# EAGLE schematic irboard (EAGLE 9.5.1)
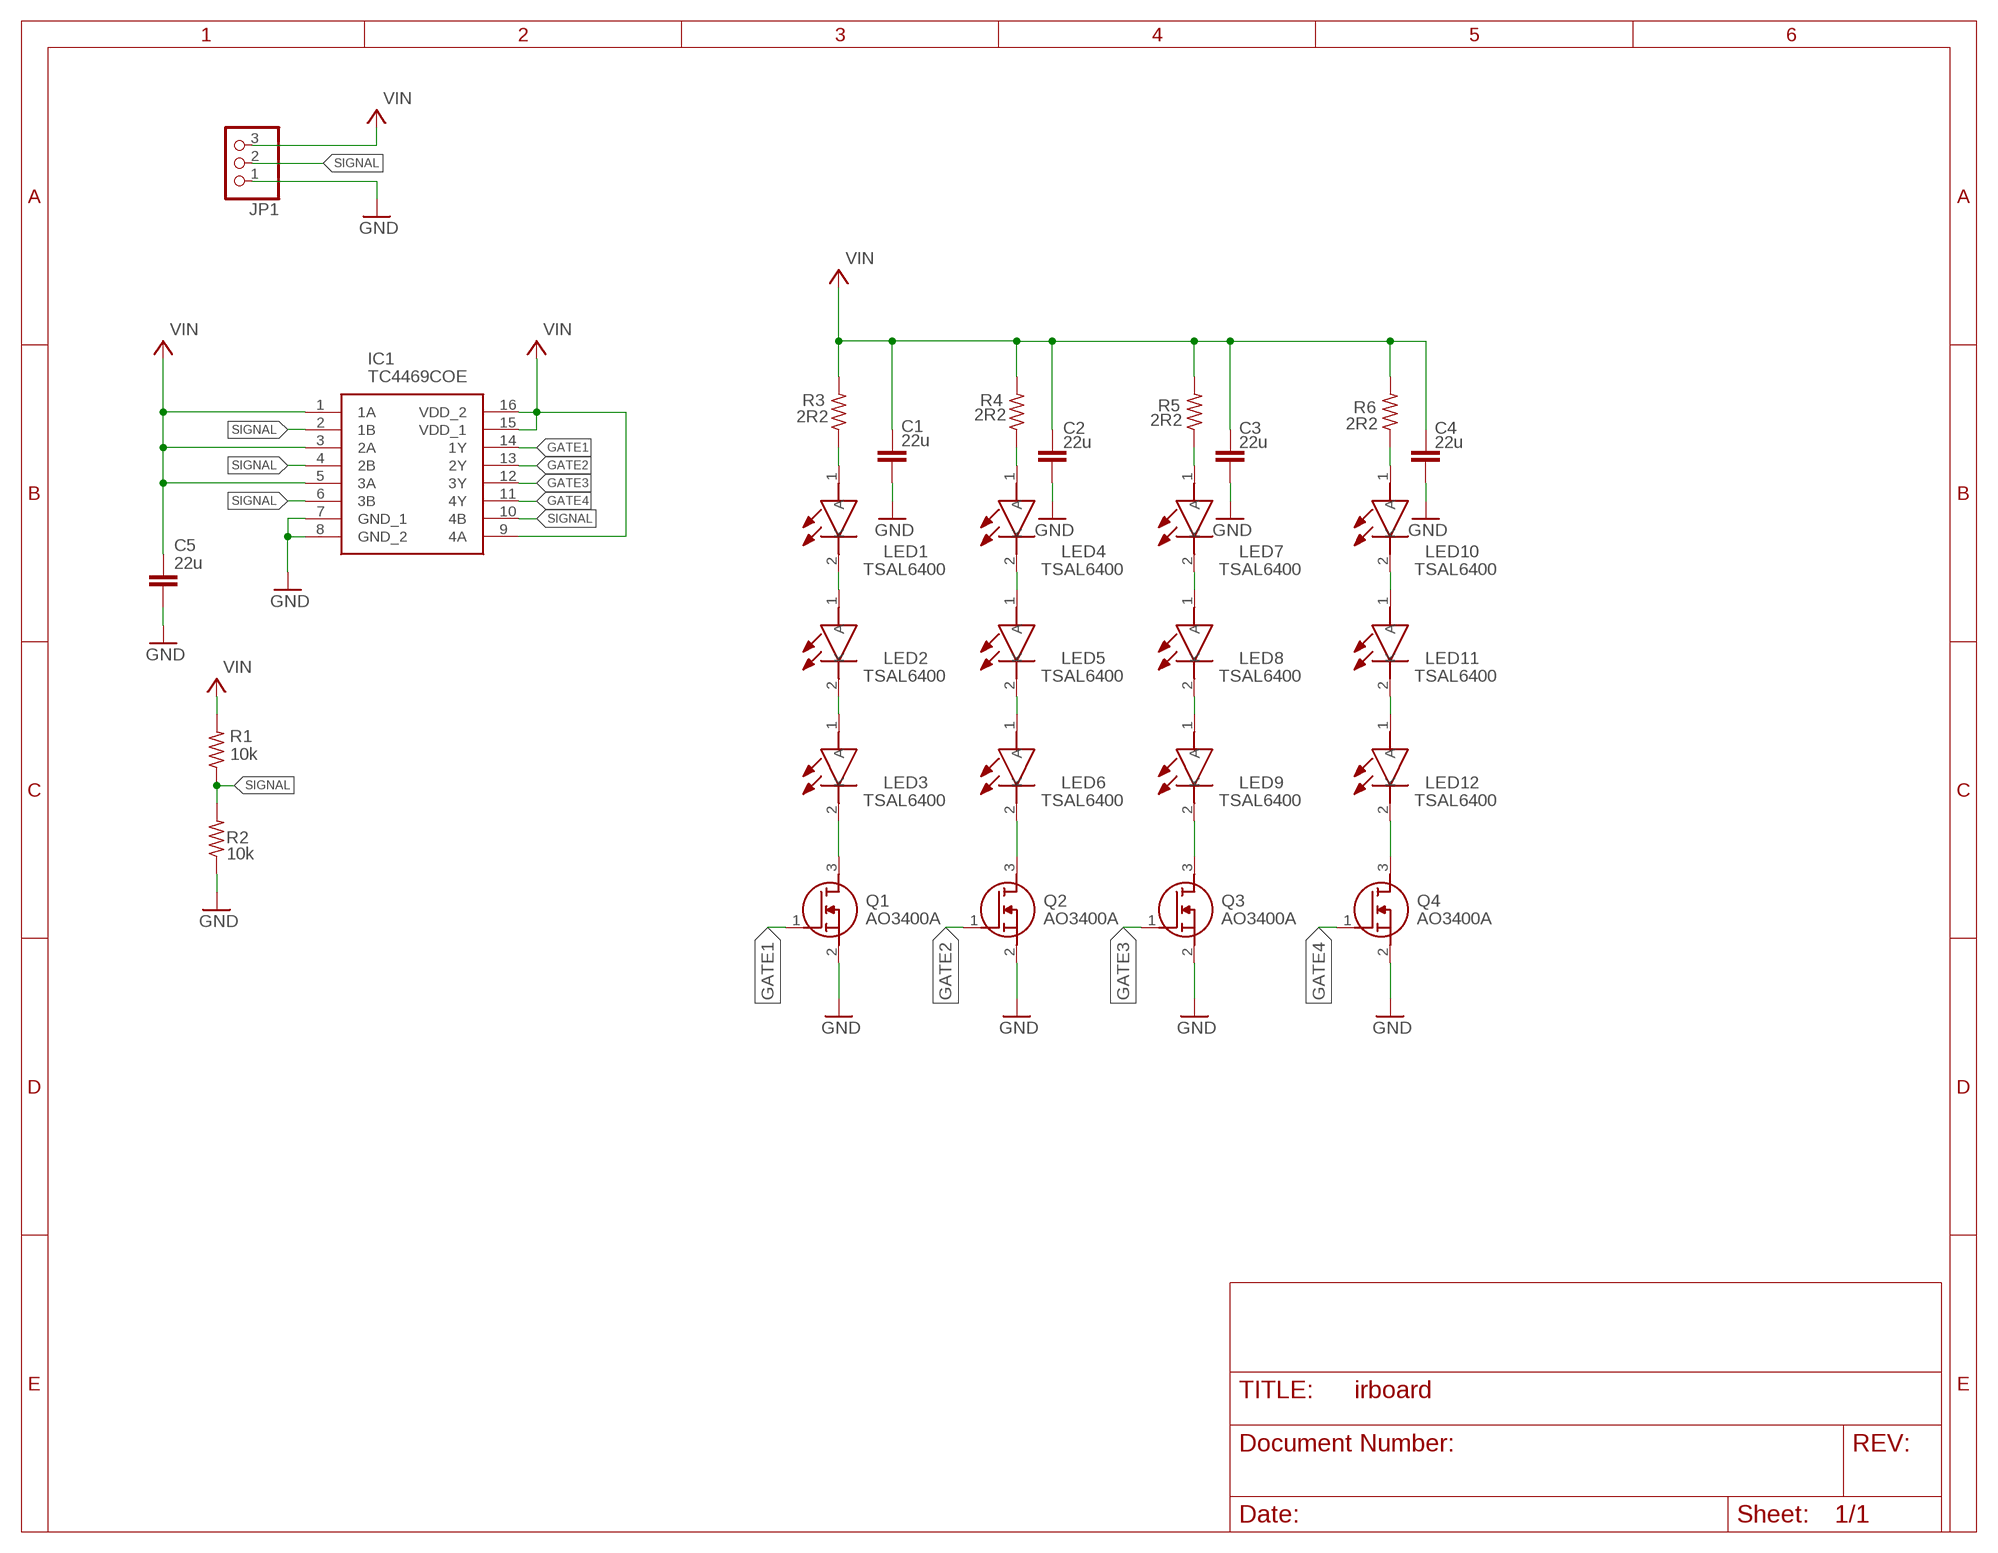
[diagram p0: schematic, sheet 1]

## Parts
C1  22u  CAP_SMD0805  [C0805]
C2  22u  CAP_SMD0805  [C0805]
C3  22u  CAP_SMD0805  [C0805]
C4  22u  CAP_SMD0805  [C0805]
C5  22u  CAP_SMD0805  [C0805]
IC1  TC4469COE  [SOIC127P1034X264-16N]
JP1  PINHD-1X3  [1X03]
LED1  TSAL6400  [TSAL6100]
LED2  TSAL6400  [TSAL6100]
LED3  TSAL6400  [TSAL6100]
LED4  TSAL6400  [TSAL6100]
LED5  TSAL6400  [TSAL6100]
LED6  TSAL6400  [TSAL6100]
LED7  TSAL6400  [TSAL6100]
LED8  TSAL6400  [TSAL6100]
LED9  TSAL6400  [TSAL6100]
LED10  TSAL6400  [TSAL6100]
LED11  TSAL6400  [TSAL6100]
LED12  TSAL6400  [TSAL6100]
Q1  AO3400A  [SOT95P280X125-3N]
Q2  AO3400A  [SOT95P280X125-3N]
Q3  AO3400A  [SOT95P280X125-3N]
Q4  AO3400A  [SOT95P280X125-3N]
R1  10k  RES_SMD0603  [R0603]
R2  10k  RES_SMD0603  [R0603]
R3  2R2  RES_SMD0603  [R0603]
R4  2R2  RES_SMD0603  [R0603]
R5  2R2  RES_SMD0603  [R0603]
R6  2R2  RES_SMD0603  [R0603]

## Nets
GATE1: IC1.14(1Y) Q1.1(G)
GATE2: IC1.13(2Y) Q2.1(G)
GATE3: IC1.12(3Y) Q3.1(G)
GATE4: IC1.11(4Y) Q4.1(G)
GND: C1.2 C2.2 C3.2 C4.2 C5.2 IC1.7(GND_1) IC1.8(GND_2) JP1.1 Q1.2(S) Q2.2(S) Q3.2(S) Q4.2(S) R2.1
N$1: LED3.2(K) Q1.3(D)
N$2: LED2.2(K) LED3.1(A)
N$3: LED1.2(K) LED2.1(A)
N$4: LED4.2(K) LED5.1(A)
N$5: LED5.2(K) LED6.1(A)
N$6: LED6.2(K) Q2.3(D)
N$7: LED7.2(K) LED8.1(A)
N$8: LED8.2(K) LED9.1(A)
N$9: LED9.2(K) Q3.3(D)
N$10: LED10.2(K) LED11.1(A)
N$11: LED11.2(K) LED12.1(A)
N$12: LED12.2(K) Q4.3(D)
N$13: LED1.1(A) R3.1
N$15: LED4.1(A) R4.1
N$17: LED7.1(A) R5.1
N$20: LED10.1(A) R6.1
SIGNAL: IC1.2(1B) IC1.4(2B) IC1.6(3B) IC1.10(4B) JP1.2 R1.1 R2.2
VIN: C1.1 C2.1 C3.1 C4.1 C5.1 IC1.1(1A) IC1.3(2A) IC1.5(3A) IC1.9(4A) IC1.15(VDD_1) IC1.16(VDD_2) JP1.3 R1.2 R3.2 R4.2 R5.2 R6.2

## Library data of the parts
C1-C5 = irblaster:CAP_SMD
IC1 = irblaster:TC4469COE: TC4469COE, Quad MOSFET Power Driver 1.2A, 4.5 to 18V, 16-Pin SOIC W Source: Datasheet <http://ww1.microchip.com/downloads/en/DeviceDoc/21425C.pdf>; ALLIED_NUMBER: 70046884; ALLIED_PRICE-STOCK: https://www.alliedelec.com/microchiptechnologyinc-tc4469coe/70046884/; DESCRIPTION: TC4469COE, Quad MOSFET Power Driver 1.2A, 4.5 to 18V, 16-Pin SOIC W; HEIGHT: 2.64mm; MANUFACTURER_NAME: Microchip; MANUFACTURER_PART_NUMBER: TC4469COE; MOUSER_PART_NUMBER: 579-TC4469COE; MOUSER_PRICE-STOCK: https://www.mouser.com/Search/Refine.aspx?Keyword=579-TC4469COE; RS_PART_NUMBER: 6684411P; RS_PRICE-STOCK: http://uk.rs-online.com/web/p/products/6684411P
JP1 = pinhead:PINHD-1X3: PIN HEADER
LED1-LED12 = irblaster:TSAL6400: Vishay TSAL6400 IR LED, 940nm, 2-Pin Through Hole 5mm, 5mm Source: Datasheet <https://componentsearchengine.com/Datasheets/1/TSAL6400.pdf>; ALLIED_NUMBER: 70026434; ALLIED_PRICE-STOCK: https://www.alliedelec.com/siliconix-vishay-tsal6400/70026434/; DESCRIPTION: Vishay TSAL6400 IR LED, 940nm, 2-Pin Through Hole 5mm, 5mm; HEIGHT: mm; MANUFACTURER_NAME: Vishay; MANUFACTURER_PART_NUMBER: TSAL6400; MOUSER_PART_NUMBER: 782-TSAL6400; MOUSER_PRICE-STOCK: https://www.mouser.com/Search/Refine.aspx?Keyword=782-TSAL6400; RS_PART_NUMBER: 8187672; RS_PRICE-STOCK: https://uk.rs-online.com/web/p/products/8187672
Q1-Q4 = irblaster:AO3400A: 30V N-Channel MOSFET Source: Datasheet <http://aosmd.com/res/data_sheets/AO3400A.pdf>; DESCRIPTION: 30V N-Channel MOSFET; HEIGHT: 1.25mm; MANUFACTURER_NAME: Alpha & Omega Semiconductors; MANUFACTURER_PART_NUMBER: AO3400A
R1-R6 = irblaster:RES_SMD